# Altium schematic sheet 50Hz陷波器（两次陷波）.SchDoc
size A4
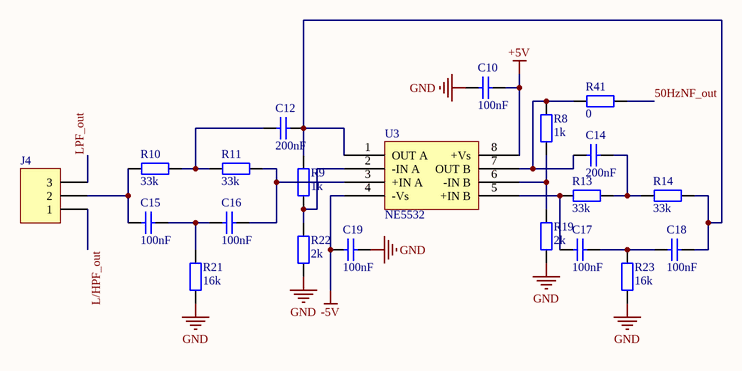
[diagram p0: 50Hz陷波器（两次陷波）.SchDoc]

## Parts
C10  100nF  [LC-0805_C]
C12  200nF  [LC-0805_C]
C14  200nF  [LC-0805_C]
C15  100nF  [LC-0805_C]
C16  100nF  [LC-0805_C]
C17  100nF  [LC-0805_C]
C18  100nF  [LC-0805_C]
C19  100nF  [LC-0805_C]
J4  ������  [HDR1X3]  (value not drawn)
R8  1k  [LC-0805_R]
R9  1k  [LC-0805_R]
R10  33k  [LC-0805_R]
R11  33k  [LC-0805_R]
R13  33k  [LC-0805_R]
R14  33k  [LC-0805_R]
R19  2k  [LC-0805_R]
R21  16k  [LC-0805_R]
R22  2k  [LC-0805_R]
R23  16k  [LC-0805_R]
R41  0  [LC-0805_R]
U3  NE5532  [DIP-8]

## Nets
+5V: C10.1 U3.8(+Vs)
-5V: C19.2 U3.4(-Vs)
GND: C10.2 C19.1 R19.1 R21.1 R22.1 R23.1
50HzNF_out: R41.2
L/HPF_out: J4.1
LPF_out: J4.3
NetC12_1: C12.1 C18.1 R9.2 R14.2 U3.1(OUT_A)
NetC12_2: C12.2 R10.2 R11.1
NetC14_1: C14.1 R13.2 R14.1
NetC14_2: C14.2 R8.2 R41.1 U3.7(OUT_B)
NetC15_1: C15.1 C16.2 R21.2
NetC15_2: C15.2 J4.2 R10.1
NetC16_1: C16.1 R11.2 U3.3(+IN_A)
NetC17_1: C17.1 C18.2 R23.2
NetC17_2: C17.2 R13.1 U3.5(+IN_B)
NetR8_1: R8.1 R19.2 U3.6(-IN_B)
NetR9_1: R9.1 R22.2 U3.2(-IN_A)

## Library data of the parts
C10 C12 C14-C19 = Cap: 100nF��0805��50V,+/-10%
J4 = Header 3: 1*3Pin,2.54mm��൥����; LatestRevisionDate: 17-Jul-2002; LatestRevisionNote: Re-released for DXP Platform.; Publisher: Altium Limited
R8-R11 R13 R14 R19 R21-R23 R41 = R: 10k��,0805,��5%
U3 = NE5532: NE5532��SO-8